# EAGLE design ArduSensor-Magnet (EAGLE 6.0)
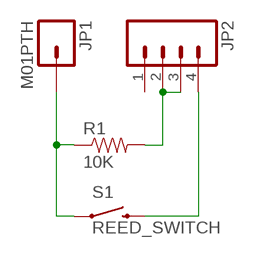
[diagram p0: schematic, sheet 1]

## Parts
JP1  M01PTH  [1X01]
JP2  M04PTH  [1X04]
R1  10K  RESISTORAXIAL-0.3  [AXIAL-0.3]
S1  REED_SWITCH  SWITCH-MOMENTARY-2PTH_REED2  [REED_SWITCH_PLASTIC]

## Nets
N$1: JP1.1 R1.P$1 S1.P$1
N$2: JP2.2 JP2.3 R1.P$2
N$3: JP2.4 S1.P$2
Unconnected: JP2.1

## Library data of the parts
JP1 = SFE Connectors:M01: Header 1 Standard 1-pin 0.1" header. Use with straight break away headers (SKU : PRT-00116), right angle break away headers (PRT-00553), swiss pins (PRT-00743), machine pins (PRT-00117), and female headers (PRT-00115).
JP2 = SFE Connectors:M04: Header 4 Standard 4-pin 0.1" header. Use with straight break away headers (SKU : PRT-00116), right angle break away headers (PRT-00553), swiss pins (PRT-00743), machine pins (PRT-00117), and female headers (PRT-00115). Molex polarized connector foot print use with SKU : PRT-08231 with associated crimp pins and housings. 1MM SMD Version SKU: PRT-10208
R1 = SFE Passives:RESISTOR: Resistor Basic schematic elements and footprints for 0603, 1206, and PTH resistors.
S1 = SFE Electromechanical:SWITCH-MOMENTARY-2: Various NO switches- pushbuttons, reed, etc

## Board
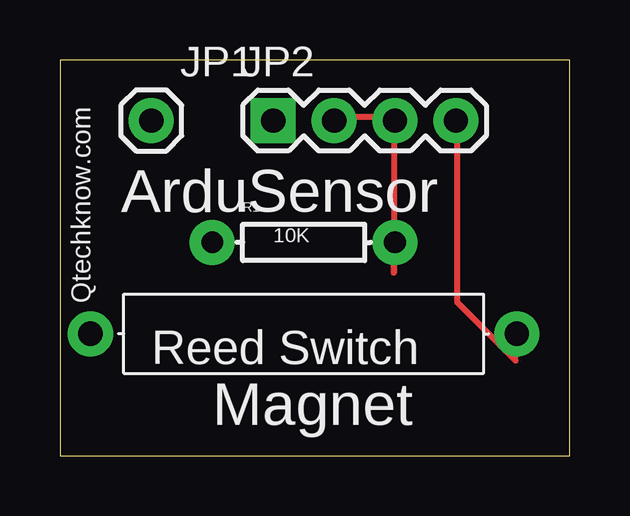
[diagram p1: board, top side]
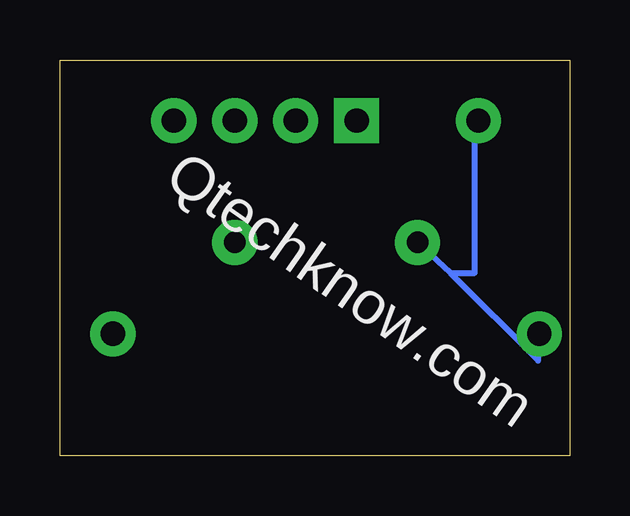
[diagram p2: board, bottom side, seen from below]

Size 21.26 x 16.5 mm. Coordinates in mm from the lower left corner, seen from the top.
Outline: 0,0 21.26,0 21.26,16.5 0,16.5 0,0
Copper layers (1*16): Top 0.035mm / dielectric 1.5mm / Bottom 0.035mm
Design rules: minimum track width 10mil, minimum drill 24mil, track to track 8mil, track to pad 8mil, pad to pad 8mil, via to via 8mil, smd to smd 8mil, copper to edge 40mil, drill to drill 8mil, minimum pad ring 10mil, minimum via ring 8mil, stop-mask expansion 4mil, vias tented up to drill 0mil, thermal gap 10mil

### Footprints (pad centres in the part's own frame; a part is rotated, then mirrored left to right if it is on the bottom)
1X01 = drill 1.016 pad 1.88: 1 0,0
1X04 = drill 1.016 pad 1.88 square: 1 0,0 | drill 1.016 pad 1.88: 2 2.54,0; 3 5.08,0; 4 7.62,0
AXIAL-0.3 = drill 0.9 pad 1.88: P$1 -3.81,0; P$2 3.81,0
REED_SWITCH_PLASTIC = drill 1.016 pad 1.88: P$1 -8.89,0; P$2 8.89,0

### Placement (x,y rotation side)
JP1  3.81,13.97 0 top
JP2  8.89,13.97 0 top
R1  [AXIAL-0.3]  10.16,8.89 0 top
S1  SWITCH-MOMENTARY-2PTH_REED2  [REED_SWITCH_PLASTIC]  10.16,5.08 0 top

### Tracks (layer width: path | path; a pad name or v marks a point on that pad's centre or on a via)
N$1
  Bottom 0.254: 4.98,7.62 1.32,3.96 S1.P$1 | R1.P$1 4.98,7.62 | 4.98,7.62 3.96,7.62 3.96,13.92 JP1.1
N$2
  Top 0.254: JP2.2 11.48,14.12 13.92,14.12 JP2.3 13.92,13.92 13.92,7.62 R1.P$2
N$3
  Top 0.254: S1.P$2 19,3.96 16.56,6.4 16.56,13.92 JP2.4

### Text on the board
tPlace: ArduSensor | 10K | Qtechknow.com | Reed Switch | Magnet
bPlace: Qtechknow.com